# EAGLE schematic csa_cpu816-v2.0e (EAGLE 4.15)
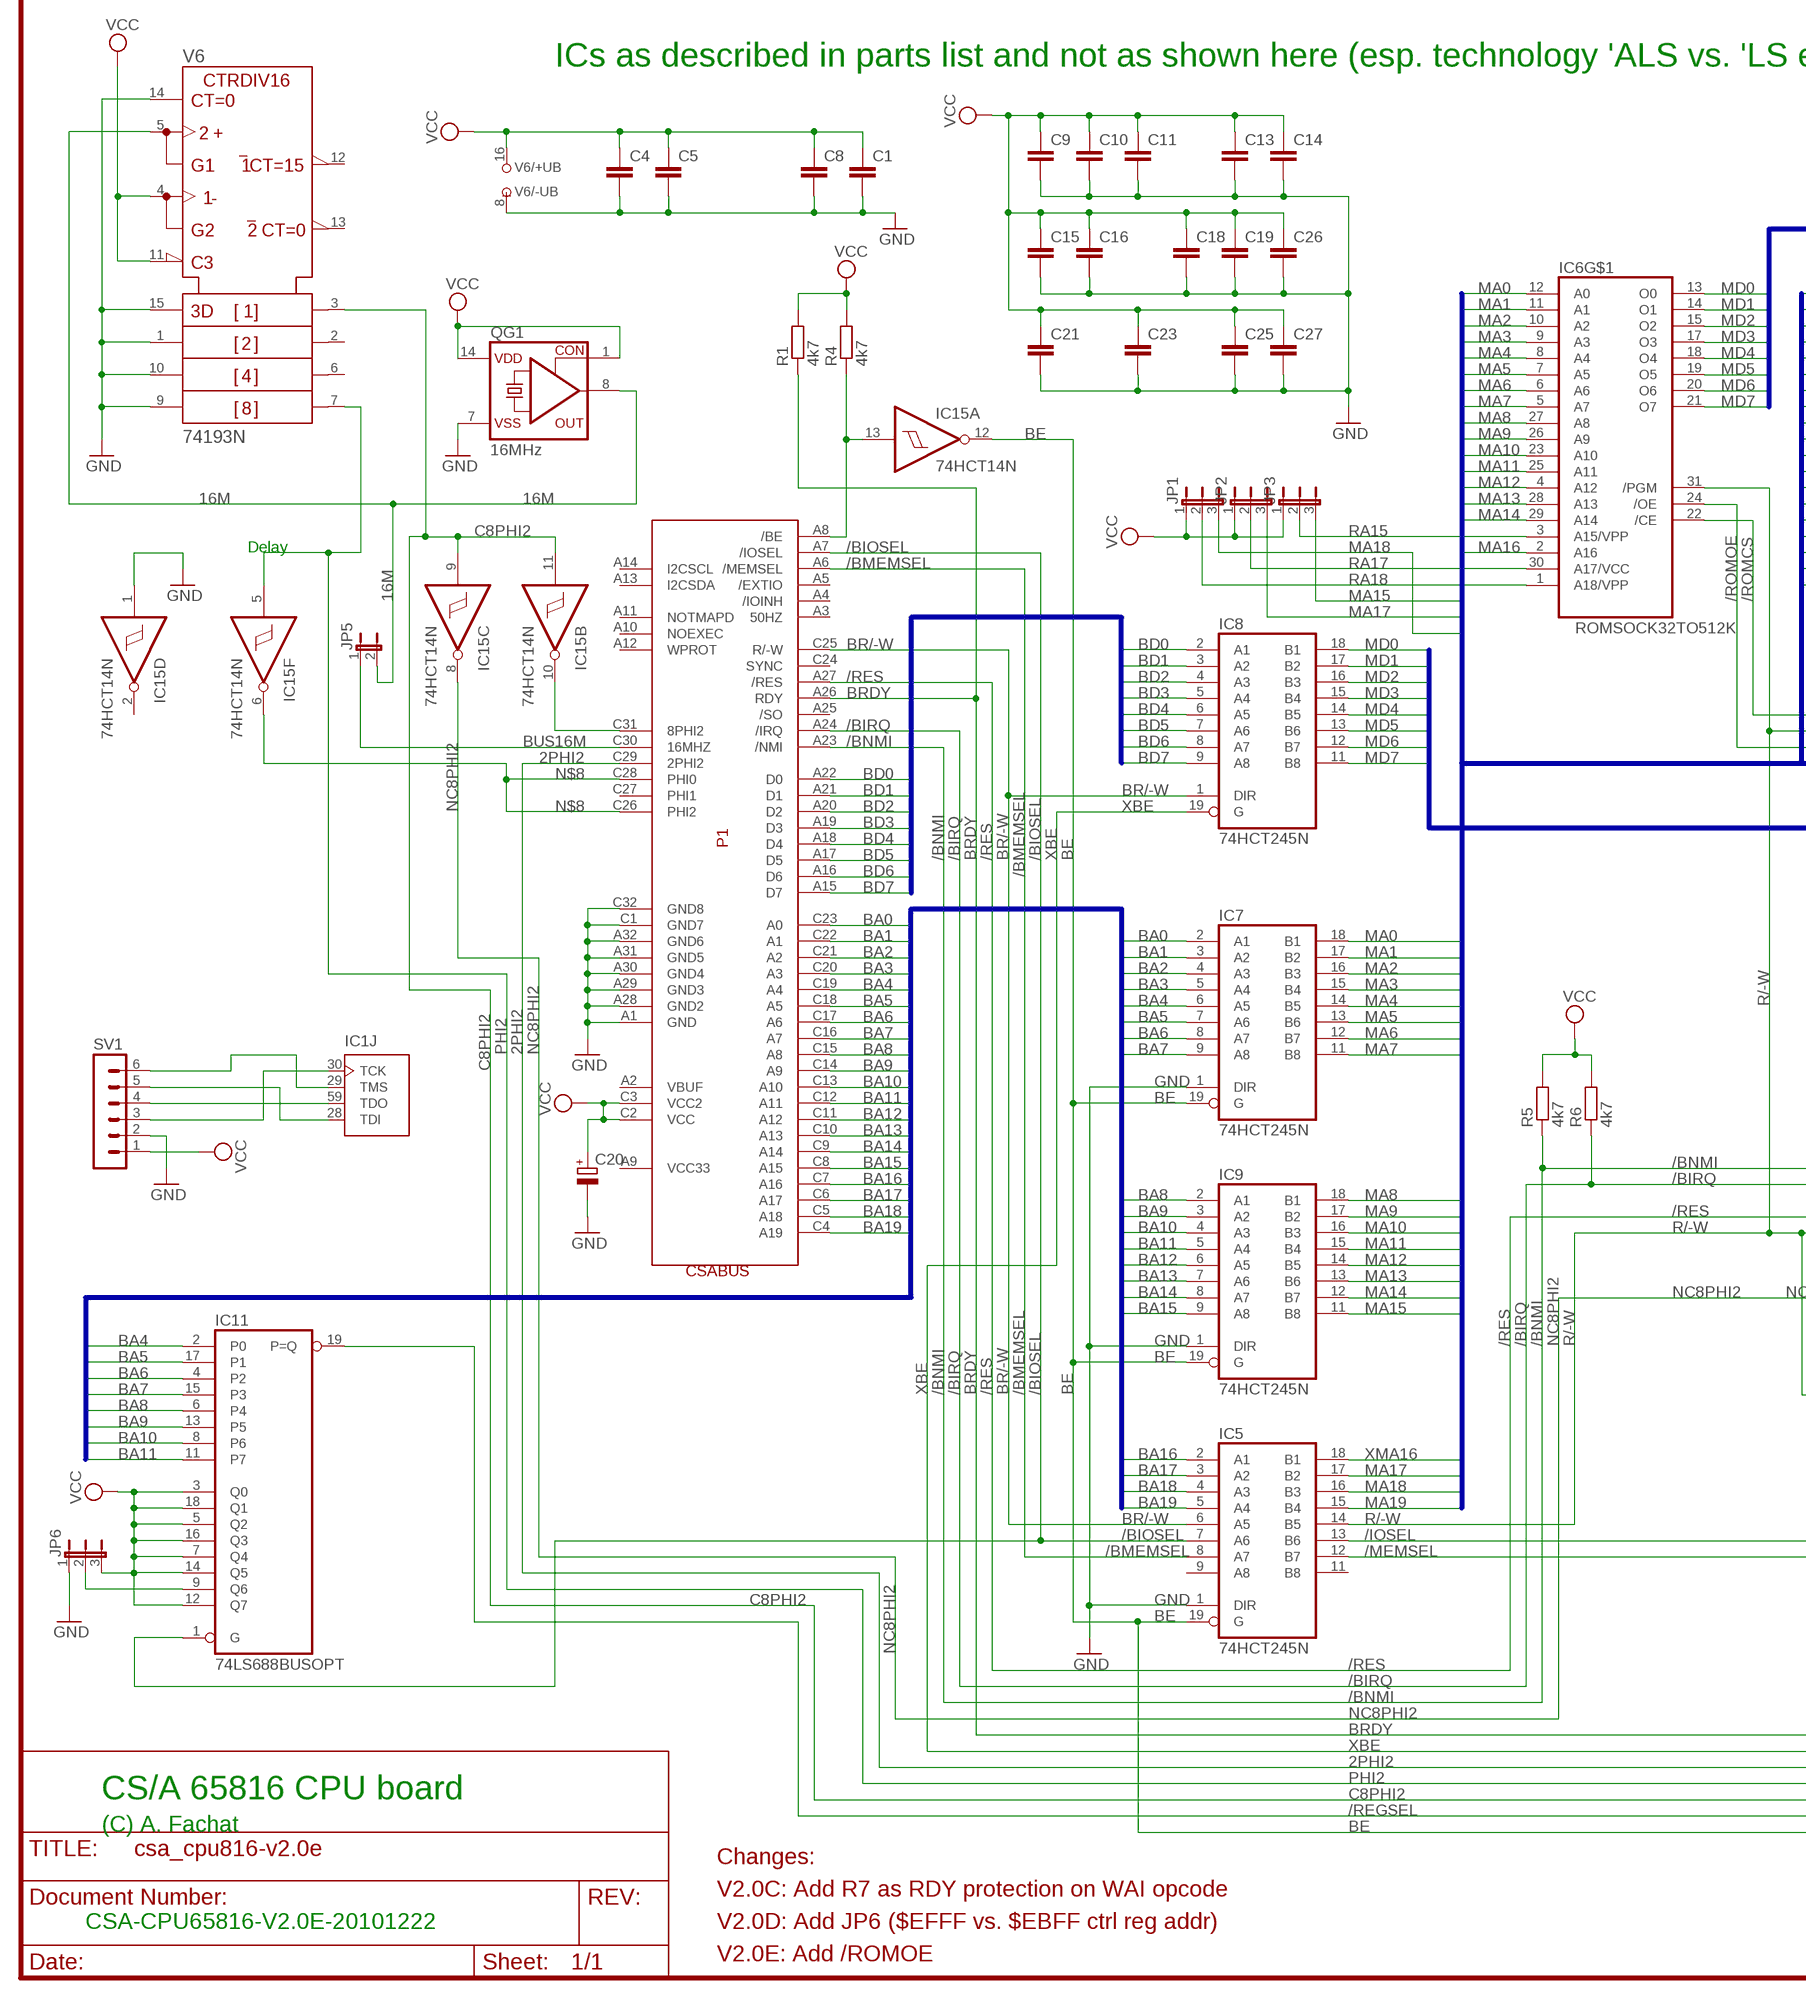
[diagram p0: schematic, sheet 1, part 1 of 2]
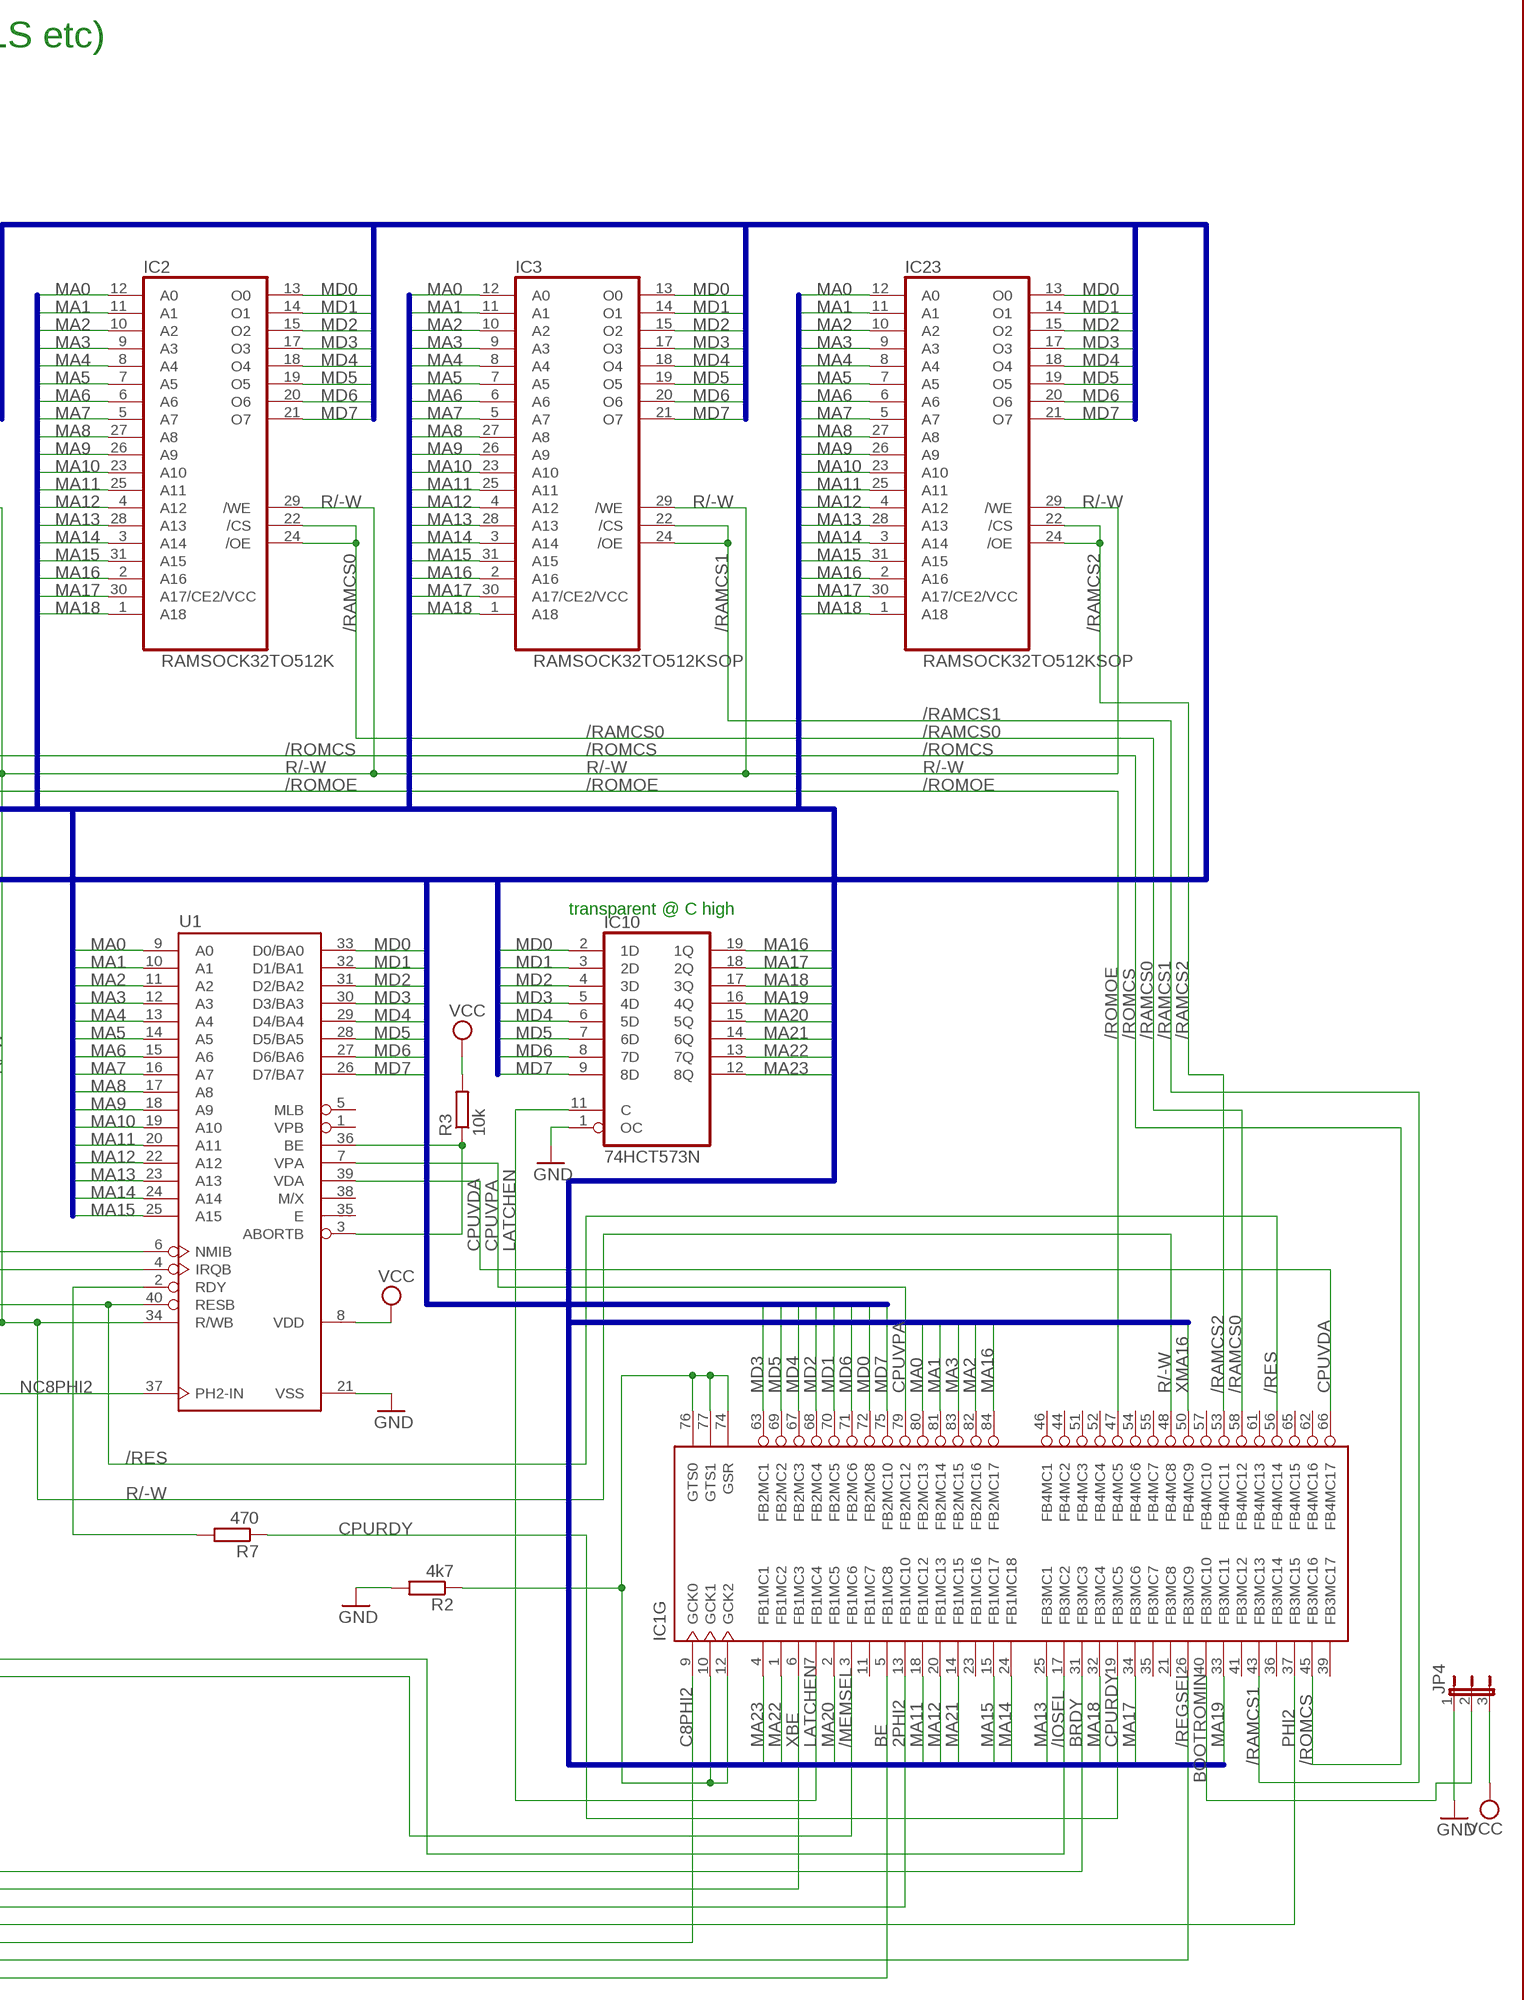
[diagram p1: schematic, sheet 1, part 2 of 2]

## Parts
C1  C-EU025-025X050  [C025-025X050]
C4  C-EU025-025X050  [C025-025X050]
C5  C-EU025-025X050  [C025-025X050]
C8  C-EU025-025X050  [C025-025X050]
C9  C-EU025-025X050  [C025-025X050]
C10  C-EU025-025X050  [C025-025X050]
C11  C-EU025-025X050  [C025-025X050]
C13  C-EU025-025X050  [C025-025X050]
C14  C-EU025-025X050  [C025-025X050]
C15  C-EU025-025X050  [C025-025X050]
C16  C-EU025-025X050  [C025-025X050]
C18  C-EU025-025X050  [C025-025X050]
C19  C-EU025-025X050  [C025-025X050]
C20  CPOL-EUE2.5-5  [E2,5-5]
C21  C-EU025-025X050  [C025-025X050]
C23  C-EU025-025X050  [C025-025X050]
C25  C-EU025-025X050  [C025-025X050]
C26  C-EU025-025X050  [C025-025X050]
C27  C-EU025-025X050  [C025-025X050]
IC1  XC9572PC84  [PLCC-S84]
IC2  RAMSOCK32TO512K  [DIL32OPT28]
IC3  RAMSOCK32TO512KSOP  [SOP32]
IC5  74HCT245N  [DIL20]
IC6  ROMSOCK32TO512K  [DIL32OPT28]
IC7  74HCT245N  [DIL20]
IC8  74HCT245N  [DIL20]
IC9  74HCT245N  [DIL20]
IC10  74HCT573N  [DIL20]
IC11  74LS688BUSOPT  [DIL20]
IC15  74HCT14N  [DIL14]
IC23  RAMSOCK32TO512KSOP  [SOP32]
JP1  JP2E  [JP2]
JP2  JP2E  [JP2]
JP3  JP2E  [JP2]
JP4  JP2E  [JP2]
JP5  JP1E  [JP1]
JP6  JP2E  [JP2]
P1  CSABUS  [CSABUS]
QG1  16MHz  CRYSTAL_RES-SG51  [SG51]
R1  4k7  R-EU_0207/10  [0207/10]
R2  4k7  R-EU_0207/10  [0207/10]
R3  10k  R-EU_0207/10  [0207/10]
R4  4k7  R-EU_0207/10  [0207/10]
R5  4k7  R-EU_0207/10  [0207/10]
R6  4k7  R-EU_0207/10  [0207/10]
R7  470  R-EU_0207/10  [0207/10]
SV1  MA06-1  [MA06-1]
U1  W65C816SP  [DIP-40]
V6  74193N  [DIL16]

## Nets
2PHI2: IC1.13(G:FB1MC10) P1.C29(2PHI2)
16M: JP5.2 QG1.8(OUT) V6.5(UP)
/BIOSEL: IC5.7(A6) IC11.1(G) P1.A7(/IOSEL)
/BIRQ: P1.A24(/IRQ) R6.1 U1.4(IRQB)
/BMEMSEL: IC5.8(A7) P1.A6(/MEMSEL)
/BNMI: P1.A23(/NMI) R5.1 U1.6(NMIB)
/IOSEL: IC1.17(G:FB3MC2) IC5.13(B6)
/MEMSEL: IC1.3(G:FB1MC6) IC5.12(B7)
/RAMCS0: IC1.58(G:FB4MC12) IC2.22(/CS) IC2.24(/OE)
/RAMCS1: IC1.43(G:FB3MC13) IC3.22(/CS) IC3.24(/OE)
/RAMCS2: IC1.53(G:FB4MC11) IC23.22(/CS) IC23.24(/OE)
/REGSEL: IC1.26(G:FB3MC9) IC11.19(P=Q)
/RES: IC1.56(G:FB4MC14) P1.A27(/RES) U1.40(RESB)
/ROMCS: IC1.45(G:FB3MC16) IC6.22(/CE)
/ROMOE: IC1.47(G:FB4MC5) IC6.24(/OE)
BA0: IC7.2(A1) P1.C23(A0)
BA1: IC7.3(A2) P1.C22(A1)
BA2: IC7.4(A3) P1.C21(A2)
BA3: IC7.5(A4) P1.C20(A3)
BA4: IC7.6(A5) IC11.2(P0) P1.C19(A4)
BA5: IC7.7(A6) IC11.17(P1) P1.C18(A5)
BA6: IC7.8(A7) IC11.4(P2) P1.C17(A6)
BA7: IC7.9(A8) IC11.15(P3) P1.C16(A7)
BA8: IC9.2(A1) IC11.6(P4) P1.C15(A8)
BA9: IC9.3(A2) IC11.13(P5) P1.C14(A9)
BA10: IC9.4(A3) IC11.8(P6) P1.C13(A10)
BA11: IC9.5(A4) IC11.11(P7) P1.C12(A11)
BA12: IC9.6(A5) P1.C11(A12)
BA13: IC9.7(A6) P1.C10(A13)
BA14: IC9.8(A7) P1.C9(A14)
BA15: IC9.9(A8) P1.C8(A15)
BA16: IC5.2(A1) P1.C7(A16)
BA17: IC5.3(A2) P1.C6(A17)
BA18: IC5.4(A3) P1.C5(A18)
BA19: IC5.5(A4) P1.C4(A19)
BD0: IC8.2(A1) P1.A22(D0)
BD1: IC8.3(A2) P1.A21(D1)
BD2: IC8.4(A3) P1.A20(D2)
BD3: IC8.5(A4) P1.A19(D3)
BD4: IC8.6(A5) P1.A18(D4)
BD5: IC8.7(A6) P1.A17(D5)
BD6: IC8.8(A7) P1.A16(D6)
BD7: IC8.9(A8) P1.A15(D7)
BE: IC1.5(G:FB1MC8) IC5.19(G) IC7.19(G) IC9.19(G) IC15.12(A:O)
BOOTROMIN: IC1.40(G:FB3MC10) JP4.2
BR/-W: IC5.6(A5) IC8.1(DIR) P1.C25(R/-W)
BRDY: IC1.31(G:FB3MC3) P1.A26(RDY) R1.1
BUS16M: JP5.1 P1.C30(16MHZ)
C8PHI2: IC1.9(G:GCK0) IC15.9(C:I) IC15.11(B:I) V6.3(QA)
CPURDY: IC1.19(G:FB3MC5) R7.1
CPUVDA: IC1.66(G:FB4MC17) U1.39(VDA)
CPUVPA: IC1.79(G:FB2MC12) U1.7(VPA)
GND: C1.2 C4.2 C5.2 C8.2 C9.2 C10.2 C11.2 C13.2 C14.2 C15.2 C16.2 C18.2 C19.2 C20.- C21.2 C23.2 C25.2 C26.2 C27.2 IC5.1(DIR) IC7.1(DIR) IC9.1(DIR) IC10.1(OC) IC15.1(D:I) JP4.1 JP6.1 P1.A1(GND) P1.A28(GND2) P1.A29(GND3) P1.A30(GND4) P1.A31(GND5) P1.A32(GND6) P1.C1(GND7) P1.C32(GND8) QG1.7(VSS) R2.2 SV1.2 U1.21(VSS) V6.1(B) V6.8(-UB) V6.9(D) V6.10(C) V6.14(CLR) V6.15(A)
LATCHEN: IC1.7(G:FB1MC4) IC10.11(C)
MA0: IC1.80(G:FB2MC13) IC2.12(A0) IC3.12(A0) IC6.12(A0) IC7.18(B1) IC23.12(A0) U1.9(A0)
MA1: IC1.81(G:FB2MC14) IC2.11(A1) IC3.11(A1) IC6.11(A1) IC7.17(B2) IC23.11(A1) U1.10(A1)
MA2: IC1.82(G:FB2MC16) IC2.10(A2) IC3.10(A2) IC6.10(A2) IC7.16(B3) IC23.10(A2) U1.11(A2)
MA3: IC1.83(G:FB2MC15) IC2.9(A3) IC3.9(A3) IC6.9(A3) IC7.15(B4) IC23.9(A3) U1.12(A3)
MA4: IC2.8(A4) IC3.8(A4) IC6.8(A4) IC7.14(B5) IC23.8(A4) U1.13(A4)
MA5: IC2.7(A5) IC3.7(A5) IC6.7(A5) IC7.13(B6) IC23.7(A5) U1.14(A5)
MA6: IC2.6(A6) IC3.6(A6) IC6.6(A6) IC7.12(B7) IC23.6(A6) U1.15(A6)
MA7: IC2.5(A7) IC3.5(A7) IC6.5(A7) IC7.11(B8) IC23.5(A7) U1.16(A7)
MA8: IC2.27(A8) IC3.27(A8) IC6.27(A8) IC9.18(B1) IC23.27(A8) U1.17(A8)
MA9: IC2.26(A9) IC3.26(A9) IC6.26(A9) IC9.17(B2) IC23.26(A9) U1.18(A9)
MA10: IC2.23(A10) IC3.23(A10) IC6.23(A10) IC9.16(B3) IC23.23(A10) U1.19(A10)
MA11: IC1.18(G:FB1MC12) IC2.25(A11) IC3.25(A11) IC6.25(A11) IC9.15(B4) IC23.25(A11) U1.20(A11)
MA12: IC1.20(G:FB1MC13) IC2.4(A12) IC3.4(A12) IC6.4(A12) IC9.14(B5) IC23.4(A12) U1.22(A12)
MA13: IC1.25(G:FB3MC1) IC2.28(A13) IC3.28(A13) IC6.28(A13) IC9.13(B6) IC23.28(A13) U1.23(A13)
MA14: IC1.24(G:FB1MC18) IC2.3(A14) IC3.3(A14) IC6.29(A14) IC9.12(B7) IC23.3(A14) U1.24(A14)
MA15: IC1.15(G:FB1MC17) IC2.31(A15) IC3.31(A15) IC9.11(B8) IC23.31(A15) JP3.3 U1.25(A15)
MA16: IC1.84(G:FB2MC17) IC2.2(A16) IC3.2(A16) IC6.2(A16) IC10.19(1Q) IC23.2(A16)
MA17: IC1.34(G:FB3MC6) IC2.30(A17/CE2/VCC) IC3.30(A17/CE2/VCC) IC5.17(B2) IC10.18(2Q) IC23.30(A17/CE2/VCC) JP2.3
MA18: IC1.32(G:FB3MC4) IC2.1(A18) IC3.1(A18) IC5.16(B3) IC10.17(3Q) IC23.1(A18) JP1.3
MA19: IC1.33(G:FB3MC11) IC5.15(B4) IC10.16(4Q)
MA20: IC1.2(G:FB1MC5) IC10.15(5Q)
MA21: IC1.14(G:FB1MC15) IC10.14(6Q)
MA22: IC1.1(G:FB1MC2) IC10.13(7Q)
MA23: IC1.4(G:FB1MC1) IC10.12(8Q)
MD0: IC1.72(G:FB2MC8) IC2.13(O0) IC3.13(O0) IC6.13(O0) IC8.18(B1) IC10.2(1D) IC23.13(O0) U1.33(D0/BA0)
MD1: IC1.70(G:FB2MC5) IC2.14(O1) IC3.14(O1) IC6.14(O1) IC8.17(B2) IC10.3(2D) IC23.14(O1) U1.32(D1/BA1)
MD2: IC1.68(G:FB2MC4) IC2.15(O2) IC3.15(O2) IC6.15(O2) IC8.16(B3) IC10.4(3D) IC23.15(O2) U1.31(D2/BA2)
MD3: IC1.63(G:FB2MC1) IC2.17(O3) IC3.17(O3) IC6.17(O3) IC8.15(B4) IC10.5(4D) IC23.17(O3) U1.30(D3/BA3)
MD4: IC1.67(G:FB2MC3) IC2.18(O4) IC3.18(O4) IC6.18(O4) IC8.14(B5) IC10.6(5D) IC23.18(O4) U1.29(D4/BA4)
MD5: IC1.69(G:FB2MC2) IC2.19(O5) IC3.19(O5) IC6.19(O5) IC8.13(B6) IC10.7(6D) IC23.19(O5) U1.28(D5/BA5)
MD6: IC1.71(G:FB2MC6) IC2.20(O6) IC3.20(O6) IC6.20(O6) IC8.12(B7) IC10.8(7D) IC23.20(O6) U1.27(D6/BA6)
MD7: IC1.75(G:FB2MC10) IC2.21(O7) IC3.21(O7) IC6.21(O7) IC8.11(B8) IC10.9(8D) IC23.21(O7) U1.26(D7/BA7)
N$1: R3.1 U1.3(ABORTB) U1.36(BE)
N$2: R7.2 U1.2(RDY)
N$3: IC1.30(J:TCK) SV1.3
N$4: IC1.59(J:TDO) SV1.4
N$5: IC1.28(J:TDI) SV1.5
N$6: IC1.29(J:TMS) SV1.6
N$7: IC1.10(G:GCK1) IC1.12(G:GCK2) IC1.74(G:GSR) IC1.76(G:GTS0) IC1.77(G:GTS1) R2.1
N$8: IC15.6(F:O) P1.C26(PHI2) P1.C28(PHI0)
N$9: IC11.9(Q6) JP6.2
N$20: IC15.13(A:I) P1.A8(/BE) R4.1
N$25: IC15.10(B:O) P1.C31(8PHI2)
NC8PHI2: IC15.8(C:O) U1.37(PH2-IN)
PHI2: IC1.37(G:FB3MC15) IC15.5(F:I) V6.7(QD)
R/-W: IC1.48(G:FB4MC8) IC2.29(/WE) IC3.29(/WE) IC5.14(B5) IC6.31(/PGM) IC23.29(/WE) U1.34(R/WB)
RA15: IC6.3(A15/VPP) JP3.2
RA17: IC6.30(A17/VCC) JP2.2
RA18: IC6.1(A18/VPP) JP1.2
VCC: C1.1 C4.1 C5.1 C8.1 C9.1 C10.1 C11.1 C13.1 C14.1 C15.1 C16.1 C18.1 C19.1 C20.+ C21.1 C23.1 C25.1 C26.1 C27.1 IC11.3(Q0) IC11.5(Q2) IC11.7(Q4) IC11.12(Q7) IC11.14(Q5) IC11.16(Q3) IC11.18(Q1) JP1.1 JP2.1 JP3.1 JP4.3 JP6.3 P1.C2(VCC) P1.C3(VCC2) QG1.1(CON) QG1.14(VDD) R1.2 R3.2 R4.2 R5.2 R6.2 SV1.1 U1.8(VDD) V6.4(DOWN) V6.11(LOAD\) V6.16(+UB)
XBE: IC1.6(G:FB1MC3) IC8.19(G)
XMA16: IC1.50(G:FB4MC9) IC5.18(B1)
Unconnected: IC1.11(G:FB1MC7) IC1.21(G:FB3MC8) IC1.23(G:FB1MC16) IC1.35(G:FB3MC7) IC1.36(G:FB3MC14) IC1.39(G:FB3MC17) IC1.41(G:FB3MC12) IC1.44(G:FB4MC2) IC1.46(G:FB4MC1) IC1.51(G:FB4MC3) IC1.52(G:FB4MC4) IC1.54(G:FB4MC6) IC1.55(G:FB4MC7) IC1.57(G:FB4MC10) IC1.61(G:FB4MC13) IC1.62(G:FB4MC16) IC1.65(G:FB4MC15) IC5.9(A8) IC5.11(B8) IC15.2(D:O) IC15.3(E:I) IC15.4(E:O) P1.A2(VBUF) P1.A3(50HZ) P1.A4(/IOINH) P1.A5(/EXTIO) P1.A9(VCC33) P1.A10(NOEXEC) P1.A11(NOTMAPD) P1.A12(WPROT) P1.A13(I2CSDA) P1.A14(I2CSCL) P1.A25(/SO) P1.C24(SYNC) P1.C27(PHI1) U1.1(VPB) U1.5(MLB) U1.35(E) U1.38(M/X) V6.2(QB) V6.6(QC) V6.12(CO\) V6.13(BO\)

## Buses
MA[0..23],XMA16
MD[0..7]
BD[0..7]
BA[0..19]

## Notes on the sheet
- ICs as described in parts list and not as shown here (esp. technology 'ALS vs. 'LS etc)
- Delay
- transparent @ C high
- CS/A 65816 CPU board
- (C) A. Fachat
- Changes:
- V2.0C: Add R7 as RDY protection on WAI opcode
- CSA-CPU65816-V2.0E-20101222 | V2.0D: Add JP6 ($EFFF vs. $EBFF ctrl reg addr)
- V2.0E: Add /ROMOE

## Power pins joined to a net without a drawn wire
GND: IC1.8(P:GND) IC1.16(P:GND) IC1.27(P:GND) IC1.42(P:GND) IC1.49(P:GND) IC1.60(P:GND) IC2.16(GND) IC3.16(GND) IC5.10(GND) IC6.16(GND) IC7.10(GND) IC8.10(GND) IC9.10(GND) IC10.10(GND) IC11.10(GND) IC15.7(P:GND) IC23.16(GND)
VCC: IC1.22(P:VCC) IC1.38(P:VCC) IC1.64(P:VCC) IC1.73(P:VCC) IC1.78(P:VCC) IC2.32(VCC) IC3.32(VCC) IC5.20(VCC) IC6.32(VCC) IC7.20(VCC) IC8.20(VCC) IC9.20(VCC) IC10.20(VCC) IC11.20(VCC) IC15.14(P:VCC) IC23.32(VCC)

## Library data of the parts
C1 C4 C5 C8-C11 C13-C16 C18 C19 C21 C23 C25-C27 = rcl:C-EU: CAPACITOR, European symbol
C20 = rcl:CPOL-EU: POLARIZED CAPACITOR, European symbol
IC1 = XILINX:XC9572PC84
IC2 IC3 IC23 = csa:RAMSOCK32TO512K
IC5 IC7-IC9 = 74xx-eu:74*245: Octal BUS TRANSCEIVER, 3-state
IC6 = csa:ROMSOCK32TO512K
IC10 = 74xx-eu:74*573: 8-bit D latch BUS DRIVER
IC11 = csa:74LS688BUSOPT
IC15 = 74xx-eu:74*14: Hex schmitt trigger INVERTER
JP1-JP4 JP6 = jumper:JP2E: JUMPER
JP5 = jumper:JP1E: JUMPER
P1 = csa:CSABUS
QG1 = crystal:CRYSTAL_RES-: CRYSTAL RESONATOR
R1-R7 = rcl:R-EU_: RESISTOR, European symbol
SV1 = con-lstb:MA06-1: PIN HEADER
U1 = 65xxx:W65C816SP: Wetern Digital Version
V6 = 74ttl-din:74*193: Synchronus 4-bit up down COUNTER